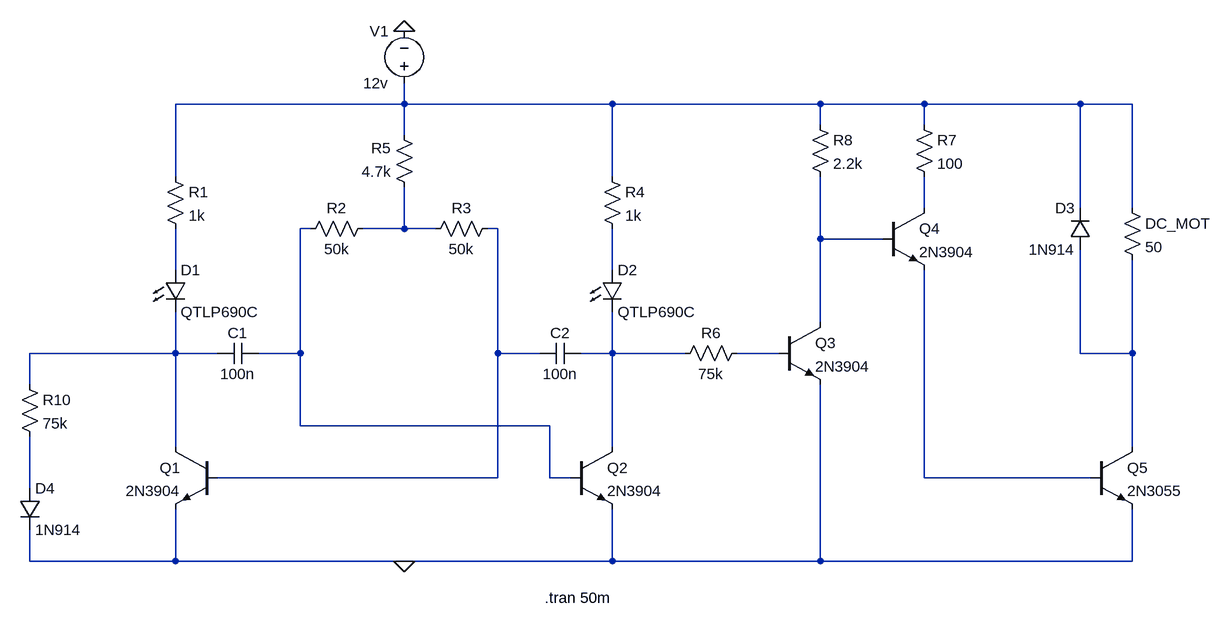
[diagram p0: schematic Astable_Multivibrator_pwm_bjt.asc]
Astable_Multivibrator_pwm_bjt.asc, the LTspice schematic file:
Version 4
SHEET 1 1972 824
WIRE 736 48 736 16
WIRE 736 48 384 48
WIRE 1056 48 736 48
WIRE 1376 48 1056 48
WIRE 1536 48 1376 48
WIRE 1776 48 1536 48
WIRE 1856 48 1776 48
WIRE 1376 80 1376 48
WIRE 1536 80 1536 48
WIRE 736 96 736 48
WIRE 384 160 384 48
WIRE 1056 160 1056 48
WIRE 1536 208 1536 160
WIRE 1776 208 1776 48
WIRE 1856 208 1856 48
WIRE 592 240 576 240
WIRE 736 240 736 176
WIRE 736 240 672 240
WIRE 784 240 736 240
WIRE 880 240 864 240
WIRE 1376 256 1376 160
WIRE 1472 256 1376 256
WIRE 384 304 384 240
WIRE 1056 304 1056 240
WIRE 1376 384 1376 256
WIRE 384 432 384 368
WIRE 384 432 160 432
WIRE 448 432 384 432
WIRE 576 432 576 240
WIRE 576 432 512 432
WIRE 880 432 880 240
WIRE 944 432 880 432
WIRE 1056 432 1056 368
WIRE 1056 432 1008 432
WIRE 1168 432 1056 432
WIRE 1312 432 1248 432
WIRE 1776 432 1776 272
WIRE 1856 432 1856 288
WIRE 1856 432 1776 432
WIRE 160 480 160 432
WIRE 576 544 576 432
WIRE 960 544 576 544
WIRE 384 576 384 432
WIRE 1056 576 1056 432
WIRE 1856 576 1856 432
WIRE 880 624 880 432
WIRE 880 624 448 624
WIRE 960 624 960 544
WIRE 992 624 960 624
WIRE 1536 624 1536 304
WIRE 1792 624 1536 624
WIRE 160 640 160 560
WIRE 160 752 160 704
WIRE 384 752 384 672
WIRE 384 752 160 752
WIRE 736 752 384 752
WIRE 1056 752 1056 672
WIRE 1056 752 736 752
WIRE 1376 752 1376 480
WIRE 1376 752 1056 752
WIRE 1856 752 1856 672
WIRE 1856 752 1376 752
FLAG 736 752 0
FLAG 736 -64 0
SYMBOL Res 368 144 R0
SYMATTR InstName R1
SYMATTR Value 1k
SYMBOL Res 1040 144 R0
SYMATTR InstName R4
SYMATTR Value 1k
SYMBOL Cap 512 416 R90
WINDOW 0 0 32 VBottom 2
WINDOW 3 32 32 VTop 2
SYMATTR InstName C1
SYMATTR Value 100n
SYMBOL Cap 1008 416 R90
WINDOW 0 0 32 VBottom 2
WINDOW 3 32 32 VTop 2
SYMATTR InstName C2
SYMATTR Value 100n
SYMBOL npn 992 576 R0
SYMATTR InstName Q2
SYMATTR Value 2N3904
SYMBOL npn 448 576 M0
SYMATTR InstName Q1
SYMATTR Value 2N3904
SYMBOL LED 368 304 R0
SYMATTR InstName D1
SYMATTR Value QTLP690C
SYMBOL LED 1040 304 R0
SYMATTR InstName D2
SYMATTR Value QTLP690C
SYMBOL Voltage 736 32 R180
WINDOW 0 24 96 Left 2
WINDOW 3 24 16 Left 2
SYMATTR InstName V1
SYMATTR Value 12v
SYMBOL Res 688 224 R90
WINDOW 0 0 56 VBottom 2
WINDOW 3 32 56 VTop 2
SYMATTR InstName R2
SYMATTR Value 50k
SYMBOL Res 880 224 R90
WINDOW 0 0 56 VBottom 2
WINDOW 3 32 56 VTop 2
SYMATTR InstName R3
SYMATTR Value 50k
SYMBOL Res 752 192 R180
WINDOW 0 36 76 Left 2
WINDOW 3 36 40 Left 2
SYMATTR InstName R5
SYMATTR Value 4.7k
SYMBOL Res 1264 416 R90
WINDOW 0 0 56 VBottom 2
WINDOW 3 32 56 VTop 2
SYMATTR InstName R6
SYMATTR Value 75k
SYMBOL npn 1312 384 R0
SYMATTR InstName Q3
SYMATTR Value 2N3904
SYMBOL npn 1472 208 R0
SYMATTR InstName Q4
SYMATTR Value 2N3904
SYMBOL npn 1792 576 R0
SYMATTR InstName Q5
SYMATTR Value 2N3055
SYMBOL Res 1520 64 R0
SYMATTR InstName R7
SYMATTR Value 100
SYMBOL Res 1840 192 R0
SYMATTR InstName DC_MOT
SYMATTR Value 50
SYMBOL Res 1360 64 R0
SYMATTR InstName R8
SYMATTR Value 2.2k
SYMBOL diode 1792 272 R180
WINDOW 0 24 64 Left 2
WINDOW 3 24 0 Left 2
SYMATTR InstName D3
SYMATTR Value 1N914
SYMBOL Res 144 464 R0
SYMATTR InstName R10
SYMATTR Value 75k
SYMBOL diode 144 640 R0
SYMATTR InstName D4
SYMATTR Value 1N914
TEXT 952 808 Left 2 !.tran 50m

The netlist it stands for:
* Astable_Multivibrator_pwm_bjt.asc
R1 N001 N007 1k
R4 N001 N008 1k
C1 N003 N009 100n
C2 N010 N005 100n
Q2 N010 N003 0 0 2N3904
Q1 N009 N005 0 0 2N3904
D1 N007 N009 QTLP690C
D2 N008 N010 QTLP690C
V1 N001 0 12v
R2 N004 N003 50k
R3 N005 N004 50k
R5 N004 N001 4.7k
R6 N011 N010 75k
Q3 N006 N011 0 0 2N3904
Q4 N002 N006 N013 0 2N3904
Q5 N012 N013 0 0 2N3055
R7 N001 N002 100
R§DC_MOT N001 N012 50
R8 N001 N006 2.2k
D3 N012 N001 1N914
R10 N009 N014 75k
D4 N014 0 1N914
.model D D
.lib standard.dio
.model NPN NPN
.model PNP PNP
.lib standard.bjt
.tran 50m
.backanno
.end